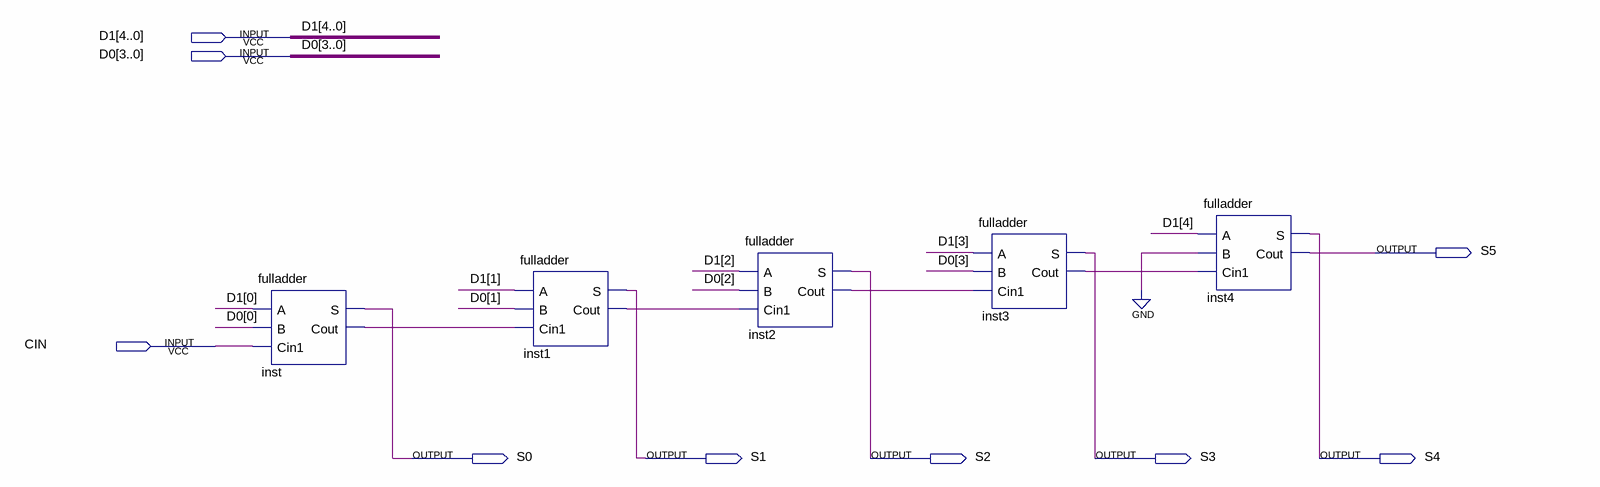
[diagram p0: schematic sheet]
// Quartus schematic ADDER.bdf as structural Verilog: 5 symbols, 9 pins
module ADDER (
  input  [4:0] D1,
  input  [3:0] D0,
  input  CIN,
  output S5,
  output S0,
  output S1,
  output S2,
  output S3,
  output S4
);

  wire inst1_cout, inst2_cout, inst3_cout, inst_cout;

  fulladder inst (.A(D1[0]), .B(D0[0]), .Cin1(CIN), .S(S0), .Cout(inst_cout));
  fulladder inst1 (.A(D1[1]), .B(D0[1]), .Cin1(inst_cout), .S(S1), .Cout(inst1_cout));
  fulladder inst2 (.A(D1[2]), .B(D0[2]), .Cin1(inst1_cout), .S(S2), .Cout(inst2_cout));
  fulladder inst3 (.A(D1[3]), .B(D0[3]), .Cin1(inst2_cout), .S(S3), .Cout(inst3_cout));
  fulladder inst4 (.A(D1[4]), .B(1'b0), .Cin1(inst3_cout), .S(S4), .Cout(S5));
endmodule
